# Altium schematic sheet Functional.SchDoc
size 420 x 297 mm; SheetNumber: 2; SheetTotal: 3
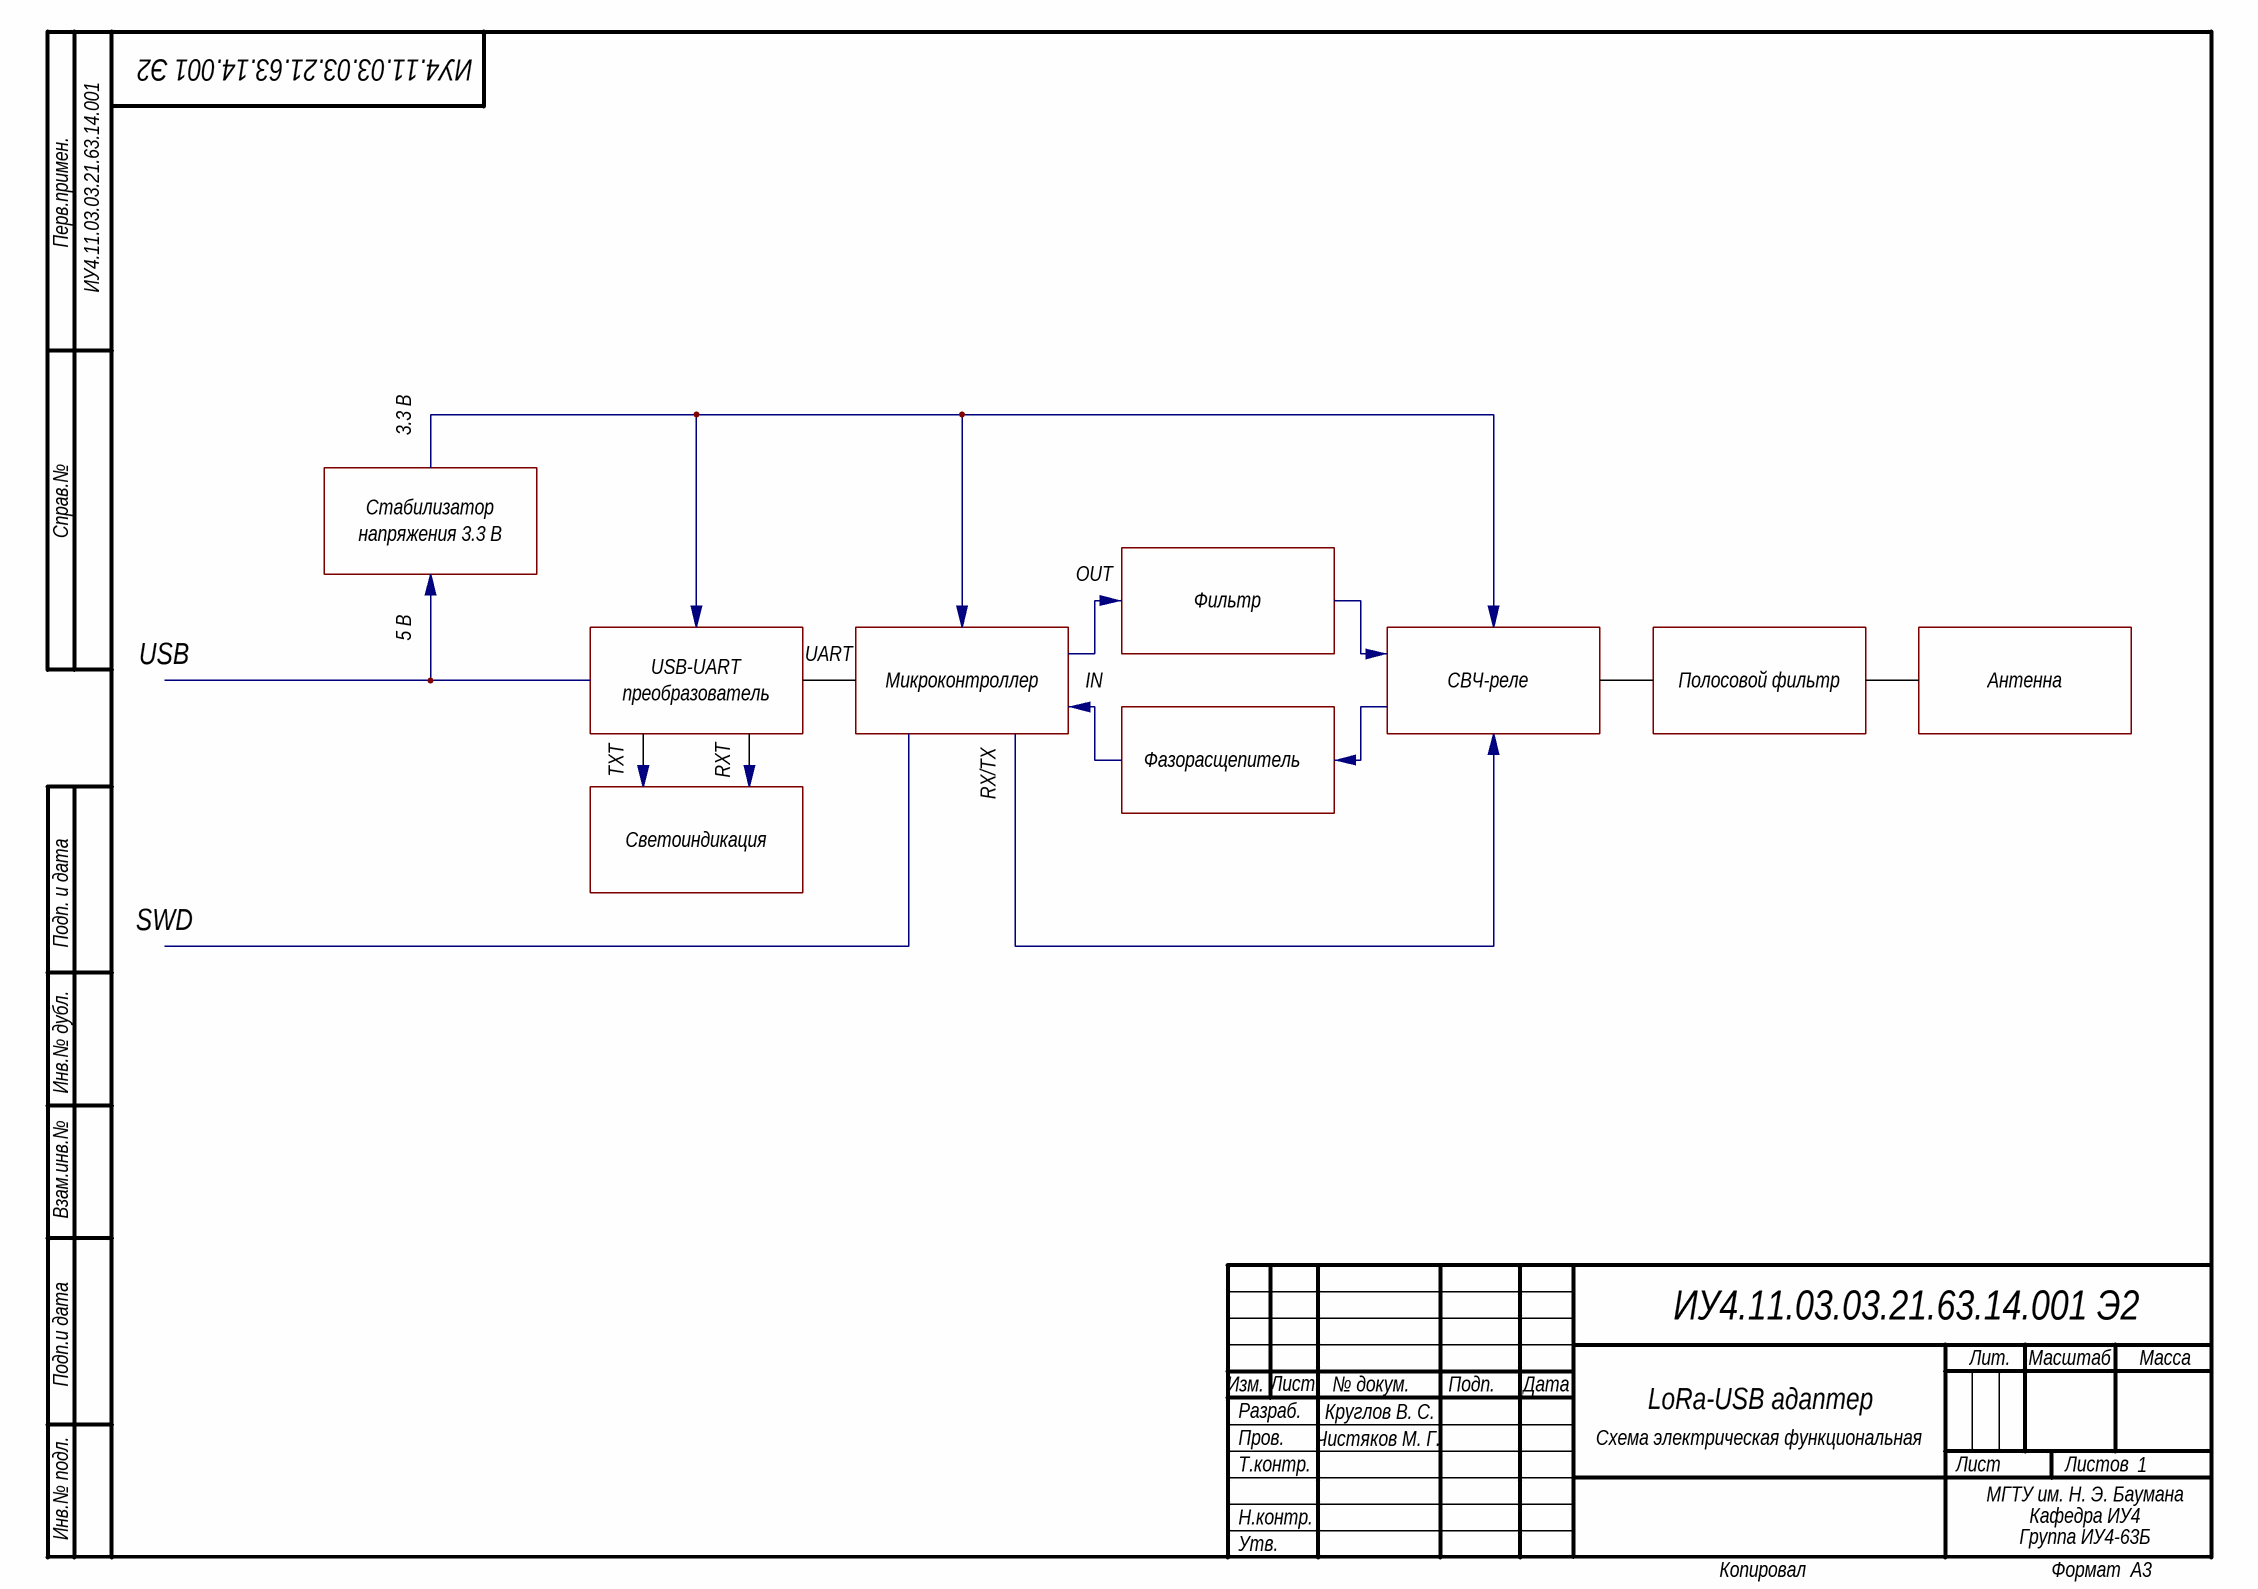
[diagram p0: Functional.SchDoc]

## Notes on the sheet
- ИУ4.11.03.03.21.63.14.001 Э2
- ИУ4.11.03.03.21.63.14.001
- 3.3 В
- Стабилизатор
- напряжения 3.3 В
- OUT
- Фильтр
- USB
- 5 В
- USB-UART
- UART
- преобразователь
- Микроконтроллер
- IN
- СВЧ-реле
- Полосовой фильтр
- Антенна
- TXT
- RXT
- RX/TX
- Фазорасщепитель
- Светоиндикация
- SWD
- Круглов В. С.
- LoRa-USB адаптер
- Чистяков М. Г.
- Схема электрическая функциональная
- 1
- МГТУ им. Н. Э. Баумана
- Кафедра ИУ4
- Группа ИУ4-63Б
- Перв.примен.
- Справ.№
- Подп. и дата
- Инв.№ дубл.
- Взам.инв.№
- Подп.и дата
- Разраб.
- Изм.
- Лист
- № докум.
- Подп.
- Дата
- Лит.
- Масштаб
- Масса
- Т.контр.
- Пров.
- Листов
- Инв.№ подл.
- Утв.
- Н.контр.
- Копировал
- Формат  A3